# EAGLE schematic akabeacon_circle_MDBT40 (EAGLE 7.4.0)
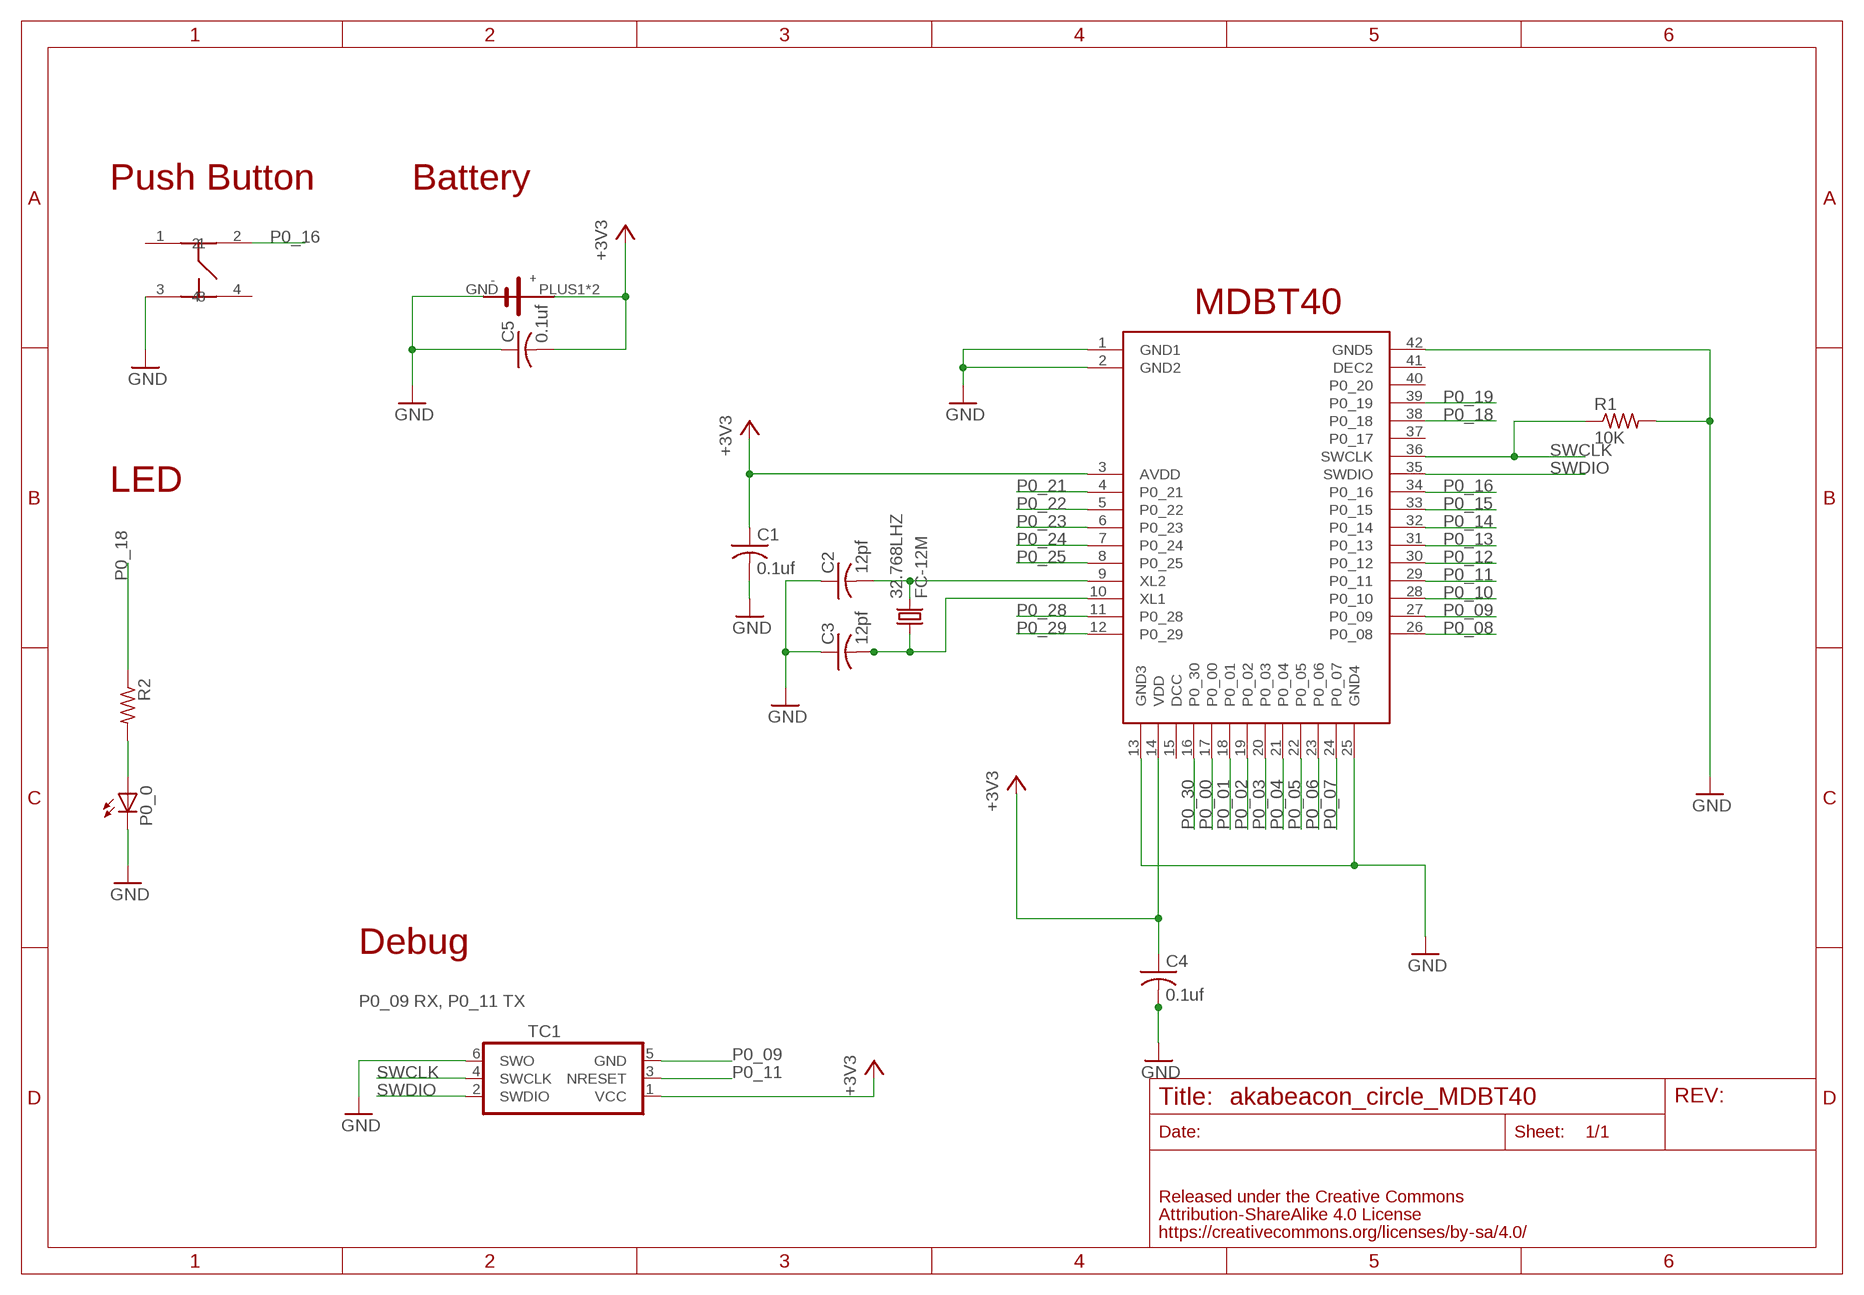
[diagram p0: schematic, sheet 1]

## Parts
32.768LHZ  FC-12M  [FC-12M]
C1  0.1uf  C-USC0603  [C0603]
C2  12pf  C-USC0603  [C0603]
C3  12pf  C-USC0603  [C0603]
C4  0.1uf  C-USC0603  [C0603]
C5  0.1uf  C-USC0603  [C0603]
P0_0  LEDCHIP-LED0603  [CHIP-LED0603]
R1  10K  R-US_R0603  [R0603]
R2  R-US_R0603  [R0603]
TC1  TC2030-IDC-NL  [TC2030-IDC-NL]
U$1  RAYTAC-MDBT40  [RAYTAC-MDBT40]
U$5  SWICTH-4P(KMR2)  [SWITCH-4P(KMR2)]
U$7  CIRCLE-TYPE1  [CIRCLE-TYE1-TC2030]

## Nets
+3V3: C1.1 C4.1 C5.2 TC1.1(VCC) U$1.3(AVDD) U$1.14(VDD) U$7.PLUS1(VCC) U$7.PLUS2(VCC)
GND: C1.2 C2.1 C3.1 C4.2 C5.1 P0_0.C R1.2 TC1.6(SWO) U$1.1(GND1) U$1.2(GND2) U$1.13(GND3) U$1.25(GND4) U$1.42(GND5) U$5.3 U$7.GND
N$1: P0_0.A R2.2
N$7: 32.768LHZ.2 C2.2 U$1.9(XL2)
N$8: 32.768LHZ.1 C3.2 U$1.10(XL1)
P0_00: U$1.17(P0_00)
P0_01: U$1.18(P0_01)
P0_02: U$1.19(P0_02)
P0_03: U$1.20(P0_03)
P0_04: U$1.21(P0_04)
P0_05: U$1.22(P0_05)
P0_06: U$1.23(P0_06)
P0_07: U$1.24(P0_07)
P0_08: U$1.26(P0_08)
P0_09: TC1.5(GND) U$1.27(P0_09)
P0_10: U$1.28(P0_10)
P0_11: TC1.3(NRESET) U$1.29(P0_11)
P0_12: U$1.30(P0_12)
P0_13: U$1.31(P0_13)
P0_14: U$1.32(P0_14)
P0_15: U$1.33(P0_15)
P0_16: U$1.34(P0_16) U$5.2
P0_18: R2.1 U$1.38(P0_18)
P0_19: U$1.39(P0_19)
P0_21: U$1.4(P0_21)
P0_22: U$1.5(P0_22)
P0_23: U$1.6(P0_23)
P0_24: U$1.7(P0_24)
P0_25: U$1.8(P0_25)
P0_28: U$1.11(P0_28)
P0_29: U$1.12(P0_29)
P0_30: U$1.16(P0_30)
SWCLK: R1.1 TC1.4(SWCLK) U$1.36(SWCLK)
SWDIO: TC1.2(SWDIO) U$1.35(SWDIO)
Unconnected: U$1.15(DCC) U$1.37(P0_17) U$1.40(P0_20) U$1.41(DEC2) U$5.1 U$5.4

## Notes on the sheet
- Push Button | Battery
- MDBT40
- LED
- Debug
- P0_09 RX, P0_11 TX

## Library data of the parts
32.768LHZ = crystal:FC-12M: kHz RANGE CRYSTAL UNIT LOW PROFILE SMD Source: Epson Toyocom FC-12M.pdf
C1-C5 = adafruit:C-US: CAPACITOR, American symbol
P0_0 = led:LED: LED OSRAM: - CHIPLED LG R971, LG N971, LY N971, LG Q971, LY Q971, LO R971, LY R971 LH N974, LH R974 LS Q976, LO Q976, LY Q976 LO Q996 - Hyper CHIPLED LW Q18S LB Q993, LB Q99A, LB R99A - SideLED LS A670, LO A670, LY A670, LG A670, LP A670 LB A673, LV A673, LT A673, LW A673 LH A674 LY A675 LS A676, LA A676, LO A676, LY A676, LW A676 LS A679, LY A679, LG A679 - Hyper Micro SIDELED® LS Y876, LA Y876, LO Y876, LY Y876 LT Y87S - SmartLED LW L88C, LW L88S LB L89C, LB L89S, LG L890 LS L89K, LO L89K, LY L89K LS L896, LA L896, LO L896, LY L896 - TOPLED LS T670, LO T670, LY T670, LG T670, LP T670 LSG T670, LSP T670, LSY T670, LOP T670, LYG T670 LG T671, LOG T671, LSG T671 LB T673, LV T673, LT T673, LW T673 LH T674 LS T676, LA T676, LO T676, LY T676, LB T676, LH T676, LSB T676, LW T676 LB T67C, LV T67C, LT T67C, LS T67K, LO T67K, LY T67K, LW E67C LS E67B, LA E67B, LO E67B, LY E67B, LB E67C, LV E67C, LT E67C LW T67C LS T679, LY T679, LG T679 LS T770, LO T770, LY T770, LG T770, LP T770 LB T773, LV T773, LT T773, LW T773 LH T774 LS E675, LA E675, LY E675, LS T675 LS T776, LA T776, LO T776, LY T776, LB T776 LHGB T686 LT T68C, LB T68C - Hyper Mini TOPLED® LB M676 - Mini TOPLED Santana® LG M470 LS M47K, LO M47K, LY M47K Source: http://www.osram.convergy.de LUXEON: - LUMILED® LXK2-PW12-R00, LXK2-PW12-S00, LXK2-PW14-U00, LXK2-PW14-V00 LXK2-PM12-R00, LXK2-PM12-S00, LXK2-PM14-U00 LXK2-PE12-Q00, LXK2-PE12-R00, LXK2-PE12-S00, LXK2-PE14-T00, LXK2-PE14-U00 LXK2-PB12-K00, LXK2-PB12-L00, LXK2-PB12-M00, LXK2-PB14-N00, LXK2-PB14-P00, LXK2-PB14-Q00 LXK2-PR12-L00, LXK2-PR12-M00, LXK2-PR14-Q00, LXK2-PR14-R00 LXK2-PD12-Q00, LXK2-PD12-R00, LXK2-PD12-S00 LXK2-PH12-R00, LXK2-PH12-S00 LXK2-PL12-P00, LXK2-PL12-Q00, LXK2-PL12-R00 Source: www.luxeon.com KINGBRIGHT: KA-3528ASYC Source: www.kingbright.com
R1 R2 = adafruit:R-US_: RESISTOR, American symbol
TC1 = TagConnect:TC2030-IDC: Tag-Connect In Circuit Programming & Debug Cable 6 Pin http://www.tag-connect.com
U$1 = FaBo-BT:RAYTAC-MDBT40
U$5 = gclue-test:SWICTH-4P(KMR2)
U$7 = GClue-Beacon:CIRCLE-TYPE1